# Altium project alarm.PrjPcb
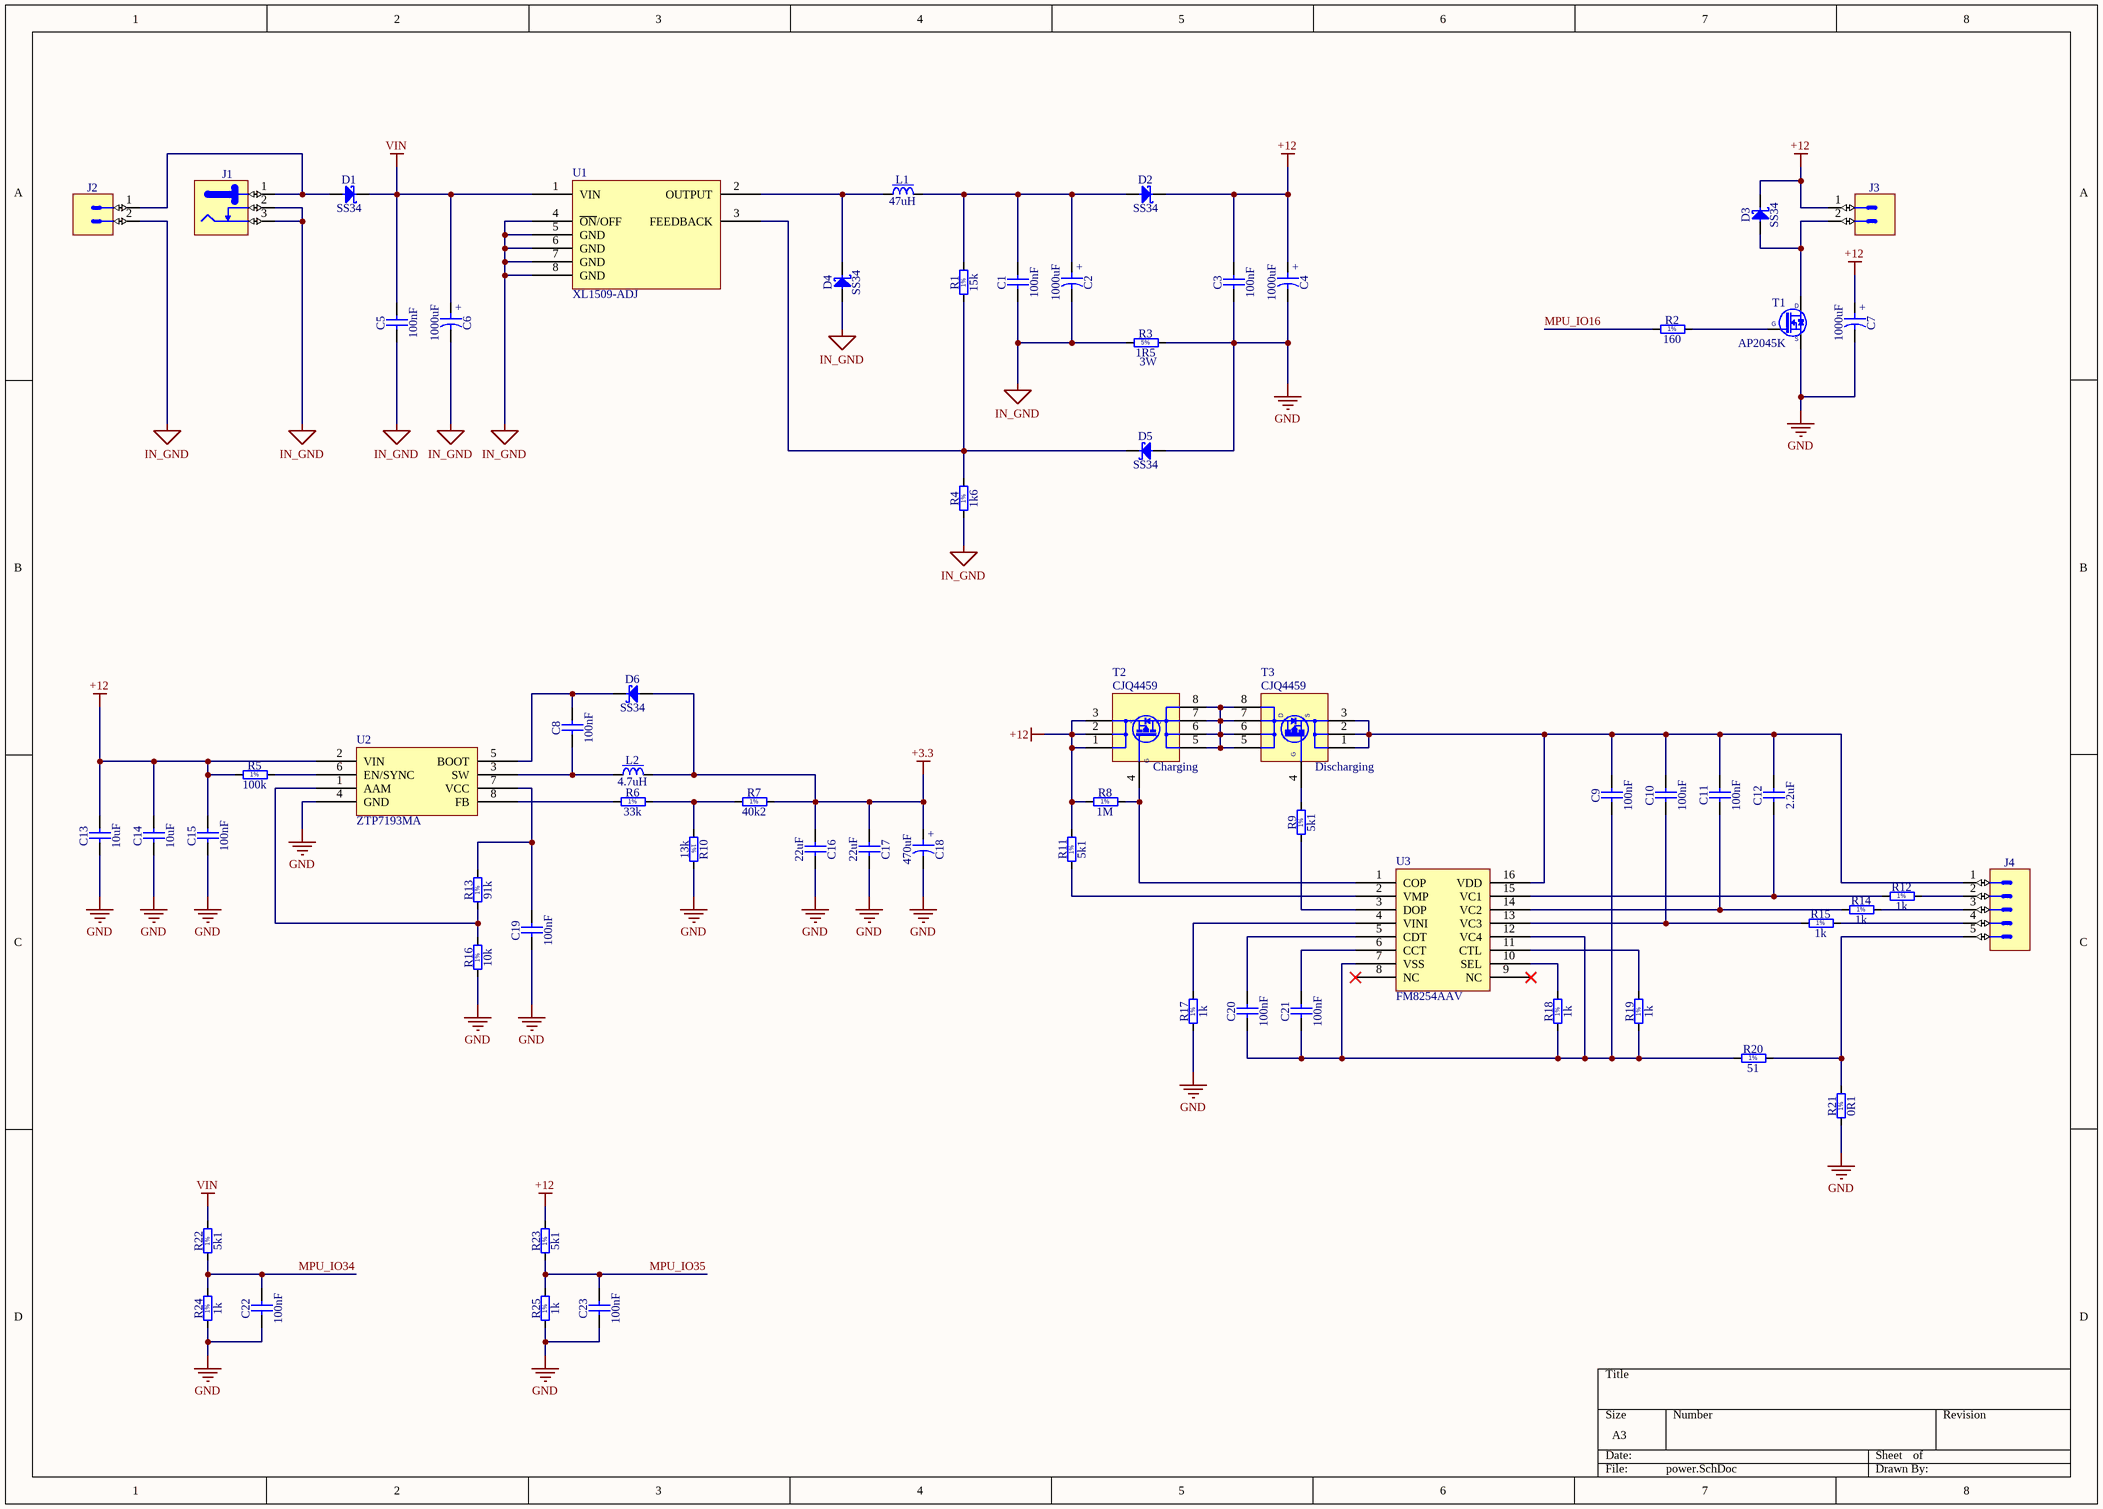
[diagram p0: power.SchDoc]
2 sheets, 80 parts. Net scope: global (net labels, ports and power ports of the same name join across sheets).
Board files: PCB1.PcbDoc, PCB2.PcbDoc
Sheets:
  power.SchDoc
  mpu.SchDoc

## Sheet power.SchDoc
size A3; SheetNumber: 1; SheetTotal: 2

### Parts
C1  100nF  [CAPC2012X135N]
C2  1000uF  [CAPPR500-1300X2200]
C3  100nF  [CAPC2012X135N]
C4  1000uF  [CAPPR500-1300X2200]
C5  100nF  [CAPC2012X135N]
C6  1000uF  [CAPPR500-1300X2200]
C7  1000uF  [CAPPR500-1300X2200]
C8  100nF  [CAPC2012X135N]
C9  100nF  [CAPC2012X135N]
C10  100nF  [CAPC2012X135N]
C11  100nF  [CAPC2012X135N]
C12  2.2uF  [CAPC2012X140N]
C13  10uF  [CAPC2012X135N]
C14  10uF  [CAPC2012X135N]
C15  100nF  [CAPC2012X135N]
C16  22uF  [CAPC2012X135N]
C17  22uF  [CAPC2012X135N]
C18  470uF  [CAPPR500-1050X1150]
C19  100nF  [CAPC2012X135N]
C20  100nF  [CAPC2012X135N]
C21  100nF  [CAPC2012X135N]
C22  100nF  [CAPC2012X135N]
C23  100nF  [CAPC2012X135N]
D1  SS34  [DIOM5127X229N]
D2  SS34  [DIOM5127X229N]
D3  SS34  [DIOM5127X229N]
D4  SS34  [DIOM5127X229N]
D5  SS34  [DIOM5127X229N]
D6  SS34  [DIOM5127X229N]
J1  Jack  [CLIFF_FC68148(DC-10A)]  (value not drawn)
J2  Header 2  [WEIDMULLER_1146320000]  (value not drawn)
J3  Header 2  [WEIDMULLER_1146320000]  (value not drawn)
J4  Header 5  [WEIDMULLER_1146410000]  (value not drawn)
L1  47uH  [IND_WURTH_WE-PD_XXL]
L2  4.7uH  [IND_WURTH_WE-TPC-2813]
R1  15k  [RESC2012X60N]
R2  160  [RESC2012X60N]
R3  1R5  [RES2286-1670X520]
R4  1k6  [RESC2012X60N]
R5  100k  [RESC2012X60N]
R6  33k  [RESC2012X60N]
R7  40k2  [RESC2012X60N]
R8  1M  [RESC2012X60N]
R9  5k1  [RESC2012X60N]
R10  13k  [RESC2012X60N]
R11  5k1  [RESC2012X60N]
R12  1k  [RESC2012X60N]
R13  91k  [RESC2012X60N]
R14  1k  [RESC2012X60N]
R15  1k  [RESC2012X60N]
R16  10k  [RESC2012X60N]
R17  1k  [RESC2012X60N]
R18  1k  [RESC2012X60N]
R19  1k  [RESC2012X60N]
R20  51  [RESC2012X60N]
R21  0R1  [RESC6432X89N]
R22  5k1  [RESC2012X60N]
R23  5k1  [RESC2012X60N]
R24  1k  [RESC2012X60N]
R25  1k  [RESC2012X60N]
T1  AP2045K  [TO228P991X239-3N-R552X520]
T2  CJQ4459  [SOIC127P600X175-8N]
T3  CJQ4459  [SOIC127P600X175-8N]
U1  XL1509-ADJ  [TI SOIC-8 D]
U2  ZTP7193MA  [SOT-23-8]
U3  FM8254AAV  [TI TSSOP-16 PW]

### Nets
+3.3: C16.1 C17.1 C18.1 D6.2(A) L2.2 R7.2
+12: C3.2 C4.1 C7.1 C13.2 C14.2 C15.2 D2.1(C) D3.1(C) J3.1 R5.1 R8.1 R11.2 R23.2 T2.1(S) T2.2(S) T2.3(S) U2.2(VIN)
GND: C3.1 C4.2 C7.2 C13.1 C14.1 C15.1 C16.2 C17.2 C18.2 C19.1 C22.1 C23.1 D5.2(A) R3.2 R10.2 R16.1 R17.1 R21.1 R24.1 R25.1 T1.2(S) U2.4(GND)
IN_GND: C1.1 C2.2 C5.1 C6.2 D4.2(A) J1.2 J1.3 J2.2 R3.1 R4.1 U1.4(~{O}~{N}/OFF) U1.5(GND) U1.6(GND) U1.7(GND) U1.8(GND)
VIN: C5.2 C6.1 D1.1(C) R22.2 U1.1(VIN)
MPU_IO16: R2.1
MPU_IO34: C22.2 R22.1 R24.2
MPU_IO35: C23.2 R23.1 R25.2
NetC1_2: C1.2 C2.1 D2.2(A) L1.2 R1.2
NetC8_1: C8.1 L2.1 U2.3(SW)
NetC8_2: C8.2 D6.1(C) U2.5(BOOT)
NetC9_1: C9.1 C20.1 C21.1 R18.1 R19.1 R20.1 U3.7(VSS) U3.12(VC4)
NetC9_2: C9.2 C10.2 C11.2 C12.2 J4.1 T3.1(S) T3.2(S) T3.3(S) U3.16(VDD)
NetC10_1: C10.1 R15.1 U3.13(VC3)
NetC11_1: C11.1 R14.1 U3.14(VC2)
NetC12_1: C12.1 R12.1 U3.15(VC1)
NetC19_2: C19.2 R13.2 U2.7(VCC)
NetC20_2: C20.2 U3.5(CDT)
NetC21_2: C21.2 U3.6(CCT)
NetD1_2: D1.2(A) J1.1 J2.1
NetD3_2: D3.2(A) J3.2 T1.3(D)
NetD4_1: D4.1(C) L1.1 U1.2(OUTPUT)
NetD5_1: D5.1(C) R1.1 R4.2 U1.3(FEEDBACK)
NetJ4_2: J4.2 R12.2
NetJ4_3: J4.3 R14.2
NetJ4_4: J4.4 R15.2
NetJ4_5: J4.5 R20.2 R21.2
NetR2_2: R2.2 T1.1(G)
NetR5_2: R5.2 U2.6(EN/SYNC)
NetR6_1: R6.1 U2.8(FB)
NetR6_2: R6.2 R7.1 R10.1
NetR8_2: R8.2 T2.4(S) U3.1(COP)
NetR9_1: R9.1 U3.3(DOP)
NetR9_2: R9.2 T3.4(S)
NetR11_1: R11.1 U3.2(VMP)
NetR13_1: R13.1 R16.2 U2.1(AAM)
NetR17_2: R17.2 U3.4(VINI)
NetR18_2: R18.2 U3.10(SEL)
NetR19_2: R19.2 U3.11(CTL)
NetT2_5: T2.5(D) T2.6(D) T2.7(D) T2.8(D) T3.5(D) T3.6(D) T3.7(D) T3.8(D)

Not connected (* = marked no-connect by the designer): U3 8(NC)* 9(NC)*

### Notes on the sheet
- (near R3) 3W
- (near T2) Charging
- (near T3) Discharging
- (in symbol CAER_470UF_10V_20%_500-1050X1150_LESR0R015) +
- (in symbol CAER_1000UF_25V_20%_RUBYCON_ZL) +
- (in symbol R0805_1K6_1%_0.125W_100PPM) 1%
- (in symbol R0805_1K_1%_0.125W_100PPM) 1%
- (in symbol R0805_1M_1%_0.125W_100PPM) 1%
- (in symbol R0805_5K1_1%_0.125W_100PPM) 1%
- (in symbol R0805_10K_1%_0.125W_100PPM) 1%
- (in symbol R0805_13K_1%_0.125W_100PPM) 1%
- (in symbol R0805_15K_1%_0.125W_100PPM) 1%
- (in symbol R0805_33K_1%_0.125W_100PPM) 1%
- (in symbol R0805_40K2_1%_0.125W_100PPM) 1%
- (in symbol R0805_51R_1%_0.125W_100PPM) 1%
- (in symbol R0805_91K_1%_0.125W_100PPM) 1%
- (in symbol R0805_100K_1%_0.125W_100PPM) 1%
- (in symbol R0805_160R_1%_0.125W_100PPM) 1%
- (in symbol R2512_0R02_1%_1W_75PPM_VISHAY_WSL) 1%
- (in symbol RMF_1R8_5%_3W_250PPM_2286-1670X520) 5%
- (in symbol SI4425DDY-T1-GE3) G

### Library data of the parts
C1 C3 C5 C8-C11 C15 C19-C23 = CC0805_100NF_50V_10%_X7R: Non-polarised capacitor; Part Description: SMD Multilayer Chip Ceramic Capacitor; Manufacturer: GENERIC; Manufacturer1 Part Number: C2012X7R1H104K085AA; Voltage: 50V; TC: X7R; Tolerance: ±10%; Part Number: CC0805_100NF_50V_10%_X7R; Component Kind: Standard; Component Type: Standard; Pin Count: 2; Value: 100nF; Status: Preferred; Manufacturer Part Number: CC0805_100NF_50V_10%_X7R; Case: 0805; Mounted: Yes; Socket: No; SMD: Yes; Sense: No; Manufacturer1 Example: TDK; Manufacturer1 ComponentHeight: 1mm; HelpURL: \\cern.ch\dfs\Applications\Altium\Datasheets\CC0805_X7R_TDK_C.pdf; Author: CERN DEM JLC; CreateDate: 03.12.2007; LatestRevisionDate: 22.04.2015
C2 C4 C6 C7 = CAER_1000UF_25V_20%_RUBYCON_ZL: Polarised capacitor; Part Description: Aluminum Electrolytic Capacitor (ZL Series); Manufacturer Part Number: 25ZL1000MEFC12.5X20; Voltage: 25V; Tolerance: ±20%; Part Number: CAER_1000UF_25V_20%_RUBYCON_ZL; Component Kind: Standard; Component Type: Standard; Pin Count: 2; Value: 1000uF; Status: None; Manufacturer: RUBYCON; Case: LS5 D13 x H22; Mounted: Yes; Socket: No; SMD: No; Sense: No; ComponentHeight: 22mm; HelpURL: \\cern.ch\dfs\Applications\Altium\Datasheets\CAER_RUBYCON_ZL.pdf; Author: CERN DEM JLC; CreateDate: 20.12.2011; LatestRevisionDate: 20.12.2011
C12 = CC0805_2.2UF_50V_10%_X7R: Non-polarised capacitor; Part Description: SMD Multilayer Chip Ceramic Capacitor; Manufacturer: GENERIC; Manufacturer1 Part Number: GRM21BR61H225KA73L; Voltage: 50V; TC: X7R; Tolerance: ±10%; Part Number: CC0805_2.2UF_50V_10%_X7R; Component Kind: Standard; Component Type: Standard; Pin Count: 2; Value: 2.2uF; Status: Preferred; Manufacturer Part Number: CC0805_2.2UF_50V_10%_X7R; Case: 0805; Mounted: Yes; Socket: No; SMD: Yes; Sense: No; Manufacturer1 Example: MURATA; Manufacturer1 ComponentHeight: 1.40mm; HelpURL: \\cern.ch\dfs\Applications\Altium\Datasheets\CC0805_X7R_MURATA_GRM.pdf; Author: CERN DEM JLC; CreateDate: 18.08.2014; LatestRevisionDate: 18.08.2014
C13 C14 = CC0805_10UF_10V_10%_X7R: Non-polarised capacitor; Part Description: SMD Multilayer Chip Ceramic Capacitor; Manufacturer: GENERIC; Manufacturer1 Part Number: GRM21BR71A106KE51L; Voltage: 10V; TC: X7R; Tolerance: ±10%; Part Number: CC0805_10UF_10V_10%_X7R; Component Kind: Standard; Component Type: Standard; Pin Count: 2; Value: 10uF; Status: Preferred; Manufacturer Part Number: CC0805_10UF_10V_10%_X7R; Case: 0805; Mounted: Yes; Socket: No; SMD: Yes; Sense: No; Manufacturer1 Example: MURATA; Manufacturer1 ComponentHeight: 1.35mm; HelpURL: \\cern.ch\dfs\Applications\Altium\Datasheets\CC0805_X7R_MURATA.pdf; Author: CERN DEM JLC; CreateDate: 30.04.2012; LatestRevisionDate: 30.04.2012
C16 C17 = CC0805_22UF_6.3V_20%_X5R: Non-polarised capacitor; Part Description: SMD Multilayer Chip Ceramic Capacitor; Manufacturer: GENERIC; Manufacturer1 Part Number: C0805C226M9PAC7800; Voltage: 6.3V; TC: X5R; Tolerance: ±20%; Part Number: CC0805_22UF_6.3V_20%_X5R; Component Kind: Standard; Component Type: Standard; Pin Count: 2; Value: 22uF; Status: Preferred; Manufacturer Part Number: CC0805_22UF_6.3V_20%_X5R; Case: 0805; Mounted: Yes; Socket: No; SMD: Yes; Sense: No; Manufacturer1 Example: KEMET; Manufacturer1 ComponentHeight: 1.45mm; HelpURL: \\cern.ch\dfs\Applications\Altium\Datasheets\CC1206_X5R_KEMET.pdf; Author: CERN DEM JLC; CreateDate: 03.12.2007; LatestRevisionDate: 03.12.2007
C18 = CAER_470UF_10V_20%_500-1050X1150_LESR0R015: Polarised capacitor; Part Description: Low ESR 0R015 Aluminum Solid Capacitor With Organic Semiconductive Electrolyte; Manufacturer: SANYO OS-CON; Manufacturer Part Number: 10SP470M; Voltage: 10V; Tolerance: ±20%; Part Number: CAER_470UF_10V_20%_500-1050X1150_LESR0R015; Component Kind: Standard; Component Type: Standard; Pin Count: 2; Value: 470uF; Status: Obsolete; Case: LS5 D10.5 x H11.5; Mounted: Yes; Socket: No; SMD: No; Sense: No; ComponentHeight: 11.5mm; HelpURL: \\cern.ch\dfs\Applications\Altium\Datasheets\CAER-LESR_SANYO_SP.pdf; Author: CERN DEM JLC; CreateDate: 29.01.2008; LatestRevisionDate: 16.03.2009
D1-D6 = SS16: Schottky Diode; Part Number: SS16; Part Description: Surface Mount Schottky Barrier Rectifier; Manufacturer: VISHAY GENERAL SEMICONDUCTOR; Voltage: 60V; Power: 1A; PressFit: No; Bonding: No; Component Kind: Standard; Component Type: Standard; Device: SS16; PackageDescription: DO-214-AC Molded Diode, Body 5.1x2.7mm, IPC Medium Density; Manufacturer Part Number: SS16; Pin Count: 2; Case: DO-214AC; Mounted: Yes; Socket: No; SMD: Yes; Sense: No; ComponentHeight: 2.29mm; HelpURL: \\cern.ch\dfs\Applications\Altium\Datasheets\SS16.pdf; Author: CERN DEM JLC; CreateDate: 15.07.2008; LatestRevisionDate: 23.08.2010
J1 = CLIFF_FC68148(DC-10A): 12V /  5A, 2.1mm Diameter Pin, DC Power Socket With  Switch. DC10A Type; Part Description: 12V/5A, 2.1mm Diameter Pin, DC Power Socket With  Switch (DC10A Type); Manufacturer: CLIFF ELECTRONIC COMPONENTS; PressFit: No; Part Number: CLIFF_FC68148(DC-10A); Component Kind: Standard; Component Type: Standard; Pin Count: 3; Family: Jack; Mounted: Yes; Socket: No; SMD: No; Sense: No; Status: None; Manufacturer Part Number: FC68148 (DC-10A); ComponentHeight: 11mm; HelpURL: \\cern.ch\dfs\Applications\Altium\Datasheets\CLIFF_FC68148(DC-10A).pdf; Author: CERN DEM JLC; CreateDate: 23.11.2010; LatestRevisionDate: 23.11.2010
J2 = WEIDMULLER_1146320000: Connector 2 Male; Part Description: 24A 400 V, Pitch 5.08mm, 2 Positions Male Header, SL 5.08HC Series; Manufacturer Part Number: 1146320000 or SL 5.08HC/02/180 3.2SN OR BX; PressFit: No; Part Number: WEIDMULLER_1146320000; Component Kind: Standard; Component Type: Standard; Pin Count: 2; Family: Header 2; Mounted: Yes; Socket: No; Sense: No; SMD: No; Status: None; Manufacturer: WEIDMULLER; ComponentHeight: 12mm; HelpURL: \\cern.ch\dfs\Applications\Altium\Datasheets\WEIDMULLER_1146320000.pdf; Author: CERN DEM JLC; CreateDate: 18.01.2012; LatestRevisionDate: 23.01.2012
J3 = WEIDMULLER_1146320000: Connector 2 Male; pin to pad: 1>2 2>1; Part Description: 24A 400 V, Pitch 5.08mm, 2 Positions Male Header, SL 5.08HC Series; Manufacturer Part Number: 1146320000 or SL 5.08HC/02/180 3.2SN OR BX; PressFit: No; Part Number: WEIDMULLER_1146320000; Component Kind: Standard; Component Type: Standard; Pin Count: 2; Family: Header 2; Mounted: Yes; Socket: No; Sense: No; SMD: No; Status: None; Manufacturer: WEIDMULLER; ComponentHeight: 12mm; HelpURL: \\cern.ch\dfs\Applications\Altium\Datasheets\WEIDMULLER_1146320000.pdf; Author: CERN DEM JLC; CreateDate: 18.01.2012; LatestRevisionDate: 23.01.2012
J4 = WEIDMULLER_1146410000: Connector 5 Male; Part Description: 24A 400 V, Pitch 5.08mm, 5 Positions Male Header, SL 5.08HC Series; Manufacturer Part Number: 1146410000 or SL 5.08HC/05/180 3.2SN OR BX; PressFit: No; Part Number: WEIDMULLER_1146410000; Component Kind: Standard; Component Type: Standard; Pin Count: 5; Family: Header 5; Mounted: Yes; Socket: No; Sense: No; SMD: No; Status: None; Manufacturer: WEIDMULLER; ComponentHeight: 12mm; HelpURL: \\cern.ch\dfs\Applications\Altium\Datasheets\WEIDMULLER_1146410000.pdf; Author: CERN DEM JLC; CreateDate: 18.01.2012; LatestRevisionDate: 23.01.2012
L1 = IND_47UH_20%_WURTH_WE-PD_7447709470: Inductor With Core; Part Description: Power-Choke Inductor (WE-PD Series); Manufacturer: WURTH ELEKTRONIK; Power: 3.8A; Resistance: 0.06R; Tolerance: ±20%; Part Number: IND_47UH_20%_WURTH_WE-PD_7447709470; Component Kind: Standard; Component Type: Standard; Pin Count: 2; Value: 47uH; Status: None; Manufacturer Part Number: 7447709470; Mounted: Yes; Socket: No; SMD: Yes; Sense: No; ComponentHeight: 10mm; HelpURL: \\cern.ch\dfs\Applications\Altium\Datasheets\IND_WURTH_WE-PD_7447709470.pdf; Author: CERN DEM JLC; CreateDate: 02.05.2011; LatestRevisionDate: 24.01.2012
L2 = IND_4.7UH_30%_WURTH_WE-TPC_744029004: Inductor With Core; Part Description: Shielded Tiny Power Inductor (WE-TPC Series); Manufacturer: WURTH ELEKTRONIK; Power: 1A; Resistance: 0.017R; Tolerance: ±30%; Part Number: IND_4.7UH_30%_WURTH_WE-TPC_744029004; Component Kind: Standard; Component Type: Standard; Pin Count: 2; Value: 4.7uH; Status: None; Manufacturer Part Number: 744029004; Mounted: Yes; Socket: No; SMD: Yes; Sense: No; ComponentHeight: 3mm; HelpURL: \\cern.ch\dfs\Applications\Altium\Datasheets\IND_WURTH_WE-TPC_744029004.pdf; Author: CERN DEM JLC; CreateDate: 20.11.2014; LatestRevisionDate: 20.11.2014
R1 = R0805_15K_1%_0.125W_100PPM: Resistor - 1%; Part Description: General Purpose Thick Film Chip Resistor; Manufacturer: GENERIC; Manufacturer1 Part Number: NRC10F1502TRF; Power: 0.125W; TC: ±100ppm/°C; PressFit: No; Part Number: R0805_15K_1%_0.125W_100PPM; Component Kind: Standard; Component Type: Standard; Pin Count: 2; Value: 15k; Status: Preferred; Tolerance: ±1%; Manufacturer Part Number: R0805_15K_1%_0.125W_100PPM; Case: 0805; Mounted: Yes; Sense: No; Socket: No; SMD: Yes; Manufacturer1 Example: NIC COMPONENT; Manufacturer1 ComponentHeight: 0.6mm; HelpURL: \\cern.ch\dfs\Applications\Altium\Datasheets\R0805_NIC_NRC.pdf; Author: CERN DEM JLC; CreateDate: 13.05.2013; LatestRevisionDate: 13.05.2013
R2 = R0805_160R_1%_0.125W_100PPM: Resistor - 1%; Part Description: General Purpose Thick Film Chip Resistor; Manufacturer: GENERIC; Manufacturer1 Part Number: NRC10F1600TRF; Power: 0.125W; TC: ±100ppm/°C; PressFit: No; Part Number: R0805_160R_1%_0.125W_100PPM; Component Kind: Standard; Component Type: Standard; Pin Count: 2; Value: 160; Status: Preferred; Tolerance: ±1%; Manufacturer Part Number: R0805_160R_1%_0.125W_100PPM; Case: 0805; Mounted: Yes; Sense: No; Socket: No; SMD: Yes; Manufacturer1 Example: NIC COMPONENT; Manufacturer1 ComponentHeight: 0.6mm; HelpURL: \\cern.ch\dfs\Applications\Altium\Datasheets\R0805_NIC_NRC.pdf; Author: CERN DEM JLC; CreateDate: 03.12.2007; LatestRevisionDate: 13.03.2008
R3 = RMF_1R8_5%_3W_250PPM_2286-1670X520: Resistor - 5%; Part Description: Leaded Power Metal Film Resistor; Manufacturer: GENERIC; Manufacturer1 Part Number: PR03000201808JAC00; Value: 1R8; Power: 3W; TC: ±250ppm/°C; PressFit: No; Part Number: RMF_1R8_5%_3W_250PPM_2286-1670X520; Component Kind: Standard; Component Type: Standard; Pin Count: 2; Status: Preferred; Tolerance: ±5%; Manufacturer Part Number: RMF_1R8_5%_3W_250PPM_2286-1670X520; Case: LS22.86 L16.7 x D5.2; Mounted: Yes; Sense: No; Socket: No; SMD: No; ComponentHeight: 5.2mm; Manufacturer1 Example: VISHAY BCCOMPONENT; Manufacturer1 ComponentHeight: 5.2mm; HelpURL: \\cern.ch\dfs\Applications\Altium\Datasheets\RMF_VISHAY_PR03.pdf; Author: CERN DEM JLC; CreateDate: 19.06.2008; LatestRevisionDate: 01.10.2012
R4 = R0805_1K6_1%_0.125W_100PPM: Resistor - 1%; Part Description: General Purpose Thick Film Chip Resistor; Manufacturer: GENERIC; Manufacturer1 Part Number: NRC10F1601TRF; Power: 0.125W; TC: ±100ppm/°C; PressFit: No; Part Number: R0805_1K6_1%_0.125W_100PPM; Component Kind: Standard; Component Type: Standard; Pin Count: 2; Value: 1k6; Status: Preferred; Tolerance: ±1%; Manufacturer Part Number: R0805_1K6_1%_0.125W_100PPM; Case: 0805; Mounted: Yes; Sense: No; Socket: No; SMD: Yes; Manufacturer1 Example: NIC COMPONENT; Manufacturer1 ComponentHeight: 0.6mm; HelpURL: \\cern.ch\dfs\Applications\Altium\Datasheets\R0805_NIC_NRC.pdf; Author: CERN DEM JLC; CreateDate: 03.12.2007; LatestRevisionDate: 13.03.2008
R5 = R0805_100K_1%_0.125W_100PPM: Resistor - 1%; Part Description: General Purpose Thick Film Chip Resistor; Manufacturer: GENERIC; Manufacturer1 Part Number: NRC10F1003TRF; Power: 0.125W; TC: ±100ppm/°C; PressFit: No; Part Number: R0805_100K_1%_0.125W_100PPM; Component Kind: Standard; Component Type: Standard; Pin Count: 2; Value: 100k; Status: Preferred; Tolerance: ±1%; Manufacturer Part Number: R0805_100K_1%_0.125W_100PPM; Case: 0805; Mounted: Yes; Sense: No; Socket: No; SMD: Yes; Manufacturer1 Example: NIC COMPONENT; Manufacturer1 ComponentHeight: 0.6mm; HelpURL: \\cern.ch\dfs\Applications\Altium\Datasheets\R0805_NIC_NRC.pdf; Author: CERN DEM JLC; CreateDate: 03.12.2007; LatestRevisionDate: 13.03.2008
R6 = R0805_33K_1%_0.125W_100PPM: Resistor - 1%; Part Description: General Purpose Thick Film Chip Resistor; Manufacturer: GENERIC; Manufacturer1 Part Number: NRC10F3302TRF; Power: 0.125W; TC: ±100ppm/°C; PressFit: No; Part Number: R0805_33K_1%_0.125W_100PPM; Component Kind: Standard; Component Type: Standard; Pin Count: 2; Value: 33k; Status: Preferred; Tolerance: ±1%; Manufacturer Part Number: R0805_33K_1%_0.125W_100PPM; Case: 0805; Mounted: Yes; Sense: No; Socket: No; SMD: Yes; Manufacturer1 Example: NIC COMPONENT; Manufacturer1 ComponentHeight: 0.6mm; HelpURL: \\cern.ch\dfs\Applications\Altium\Datasheets\R0805_NIC_NRC.pdf; Author: CERN DEM JLC; CreateDate: 03.12.2007; LatestRevisionDate: 13.03.2008
R7 = R0805_40K2_1%_0.125W_100PPM: Resistor - 1%; Part Description: Thick Film Chip Resistor; Manufacturer: VISHAY; Manufacturer1 Part Number: CRCW080540K2FKEA; Power: 0.125W; TC: ±100ppm/°C; PressFit: No; Part Number: R0805_40K2_1%_0.125W_100PPM; Component Kind: Standard; Component Type: Standard; Pin Count: 2; Value: 40k2; Status: None; Tolerance: ±1%; Manufacturer Part Number: R0805_40K2_1%_0.125W_100PPM; Case: 0805; Mounted: Yes; Sense: No; Socket: No; SMD: Yes; Manufacturer1 Example: VISHAY; Manufacturer1 ComponentHeight: 0.6mm; HelpURL: \\cern.ch\dfs\Applications\Altium\Datasheets\R2512_VISHAY_CRCW0805.pdf; Author: CERN DEM JLC; CreateDate: 18.04.2013; LatestRevisionDate: 18.04.2013
R8 = R0805_1M_1%_0.125W_100PPM: Resistor - 1%; Part Description: General Purpose Thick Film Chip Resistor; Manufacturer: GENERIC; Manufacturer1 Part Number: NRC10F1004TRF; Power: 0.125W; TC: ±100ppm/°C; PressFit: No; Part Number: R0805_1M_1%_0.125W_100PPM; Component Kind: Standard; Component Type: Standard; Pin Count: 2; Value: 1M; Status: Preferred; Tolerance: ±1%; Manufacturer Part Number: R0805_1M_1%_0.125W_100PPM; Case: 0805; Mounted: Yes; Sense: No; Socket: No; SMD: Yes; Manufacturer1 Example: NIC COMPONENT; Manufacturer1 ComponentHeight: 0.6mm; HelpURL: \\cern.ch\dfs\Applications\Altium\Datasheets\R0805_NIC_NRC.pdf; Author: CERN DEM JLC; CreateDate: 03.12.2007; LatestRevisionDate: 13.03.2008
R9 R11 R22 R23 = R0805_5K1_1%_0.125W_100PPM: Resistor - 1%; Part Description: General Purpose Thick Film Chip Resistor; Manufacturer: GENERIC; Manufacturer1 Part Number: NRC10F5101TRF; Power: 0.125W; TC: ±100ppm/°C; PressFit: No; Part Number: R0805_5K1_1%_0.125W_100PPM; Component Kind: Standard; Component Type: Standard; Pin Count: 2; Value: 5k1; Status: Preferred; Tolerance: ±1%; Manufacturer Part Number: R0805_5K1_1%_0.125W_100PPM; Case: 0805; Mounted: Yes; Sense: No; Socket: No; SMD: Yes; Manufacturer1 Example: NIC COMPONENT; Manufacturer1 ComponentHeight: 0.6mm; HelpURL: \\cern.ch\dfs\Applications\Altium\Datasheets\R0805_NIC_NRC.pdf; Author: CERN DEM JLC; CreateDate: 03.12.2007; LatestRevisionDate: 13.03.2008
R10 = R0805_13K_1%_0.125W_100PPM: Resistor - 1%; Part Description: General Purpose Thick Film Chip Resistor; Manufacturer: GENERIC; Manufacturer1 Part Number: NRC10F1302TRF; Power: 0.125W; TC: ±100ppm/°C; PressFit: No; Part Number: R0805_13K_1%_0.125W_100PPM; Component Kind: Standard; Component Type: Standard; Pin Count: 2; Value: 13k; Status: Preferred; Tolerance: ±1%; Manufacturer Part Number: R0805_13K_1%_0.125W_100PPM; Case: 0805; Mounted: Yes; Sense: No; Socket: No; SMD: Yes; Manufacturer1 Example: NIC COMPONENT; Manufacturer1 ComponentHeight: 0.6mm; HelpURL: \\cern.ch\dfs\Applications\Altium\Datasheets\R0805_NIC_NRC.pdf; Author: CERN DEM JLC; CreateDate: 03.12.2007; LatestRevisionDate: 13.03.2008
R12 R14 R15 R17-R19 R24 R25 = R0805_1K_1%_0.125W_100PPM: Resistor - 1%; Part Description: General Purpose Thick Film Chip Resistor; Manufacturer: GENERIC; Manufacturer1 Part Number: NRC10F1001TRF; Power: 0.125W; TC: ±100ppm/°C; PressFit: No; Part Number: R0805_1K_1%_0.125W_100PPM; Component Kind: Standard; Component Type: Standard; Pin Count: 2; Value: 1k; Status: Preferred; Tolerance: ±1%; Manufacturer Part Number: R0805_1K_1%_0.125W_100PPM; Case: 0805; Mounted: Yes; Sense: No; Socket: No; SMD: Yes; Manufacturer1 Example: NIC COMPONENT; Manufacturer1 ComponentHeight: 0.6mm; HelpURL: \\cern.ch\dfs\Applications\Altium\Datasheets\R0805_NIC_NRC.pdf; Author: CERN DEM JLC; CreateDate: 03.12.2007; LatestRevisionDate: 13.03.2008
R13 = R0805_91K_1%_0.125W_100PPM: Resistor - 1%; Part Description: General Purpose Thick Film Chip Resistor; Manufacturer: GENERIC; Manufacturer1 Part Number: NRC10F9102TRF; Power: 0.125W; TC: ±100ppm/°C; PressFit: No; Part Number: R0805_91K_1%_0.125W_100PPM; Component Kind: Standard; Component Type: Standard; Pin Count: 2; Value: 91k; Status: Preferred; Tolerance: ±1%; Manufacturer Part Number: R0805_91K_1%_0.125W_100PPM; Case: 0805; Mounted: Yes; Sense: No; Socket: No; SMD: Yes; Manufacturer1 Example: NIC COMPONENT; Manufacturer1 ComponentHeight: 0.6mm; HelpURL: \\cern.ch\dfs\Applications\Altium\Datasheets\R0805_NIC_NRC.pdf; Author: CERN DEM JLC; CreateDate: 03.12.2007; LatestRevisionDate: 13.03.2008
R16 = R0805_10K_1%_0.125W_100PPM: Resistor - 1%; Part Description: General Purpose Thick Film Chip Resistor; Manufacturer: GENERIC; Manufacturer1 Part Number: NRC10F1002TRF; Power: 0.125W; TC: ±100ppm/°C; PressFit: No; Part Number: R0805_10K_1%_0.125W_100PPM; Component Kind: Standard; Component Type: Standard; Pin Count: 2; Value: 10k; Status: Preferred; Tolerance: ±1%; Manufacturer Part Number: R0805_10K_1%_0.125W_100PPM; Case: 0805; Mounted: Yes; Sense: No; Socket: No; SMD: Yes; Manufacturer1 Example: NIC COMPONENT; Manufacturer1 ComponentHeight: 0.6mm; HelpURL: \\cern.ch\dfs\Applications\Altium\Datasheets\R0805_NIC_NRC.pdf; Author: CERN DEM JLC; CreateDate: 03.12.2007; LatestRevisionDate: 13.03.2008
R20 = R0805_51R_1%_0.125W_100PPM: Resistor - 1%; Part Description: General Purpose Thick Film Chip Resistor; Manufacturer: GENERIC; Manufacturer1 Part Number: NRC10F51R0TRF; Power: 0.125W; TC: ±100ppm/°C; PressFit: No; Part Number: R0805_51R_1%_0.125W_100PPM; Component Kind: Standard; Component Type: Standard; Pin Count: 2; Value: 51; Status: Preferred; Tolerance: ±1%; Manufacturer Part Number: R0805_51R_1%_0.125W_100PPM; Case: 0805; Mounted: Yes; Sense: No; Socket: No; SMD: Yes; Manufacturer1 Example: NIC COMPONENT; Manufacturer1 ComponentHeight: 0.6mm; HelpURL: \\cern.ch\dfs\Applications\Altium\Datasheets\R0805_NIC_NRC.pdf; Author: CERN DEM JLC; CreateDate: 03.12.2007; LatestRevisionDate: 13.03.2008
R21 = R2512_0R02_1%_1W_75PPM_VISHAY_WSL: Resistor - 1%; Part Description: Power Metal Strip® Resistor; Manufacturer: VISHAY DALE; Manufacturer Part Number: WSL2512R0200FEA; Value: 0R02; Power: 1W; TC: ±75ppm/°C; PressFit: No; Part Number: R2512_0R02_1%_1W_75PPM_VISHAY_WSL; Component Kind: Standard; Component Type: Standard; Pin Count: 2; Status: None; Tolerance: ±1%; Case: 2512; Mounted: Yes; Sense: No; Socket: No; SMD: Yes; ComponentHeight: 0.89mm; HelpURL: \\cern.ch\dfs\Applications\Altium\Datasheets\R2512_VISHAY_WSL.pdf; Author: CERN DEM JLC; CreateDate: 17.11.2011; LatestRevisionDate: 17.11.2011
T1 = IPD600N25N3 G: N-CHANNEL MOSFET WITH DIODE; Part Description: 250V 25A N-Channel OptiMOS Power MOSFET; Manufacturer: INFINEON; PressFit: No; Bonding: No; Part Number: IPD600N25N3 G; Component Kind: Standard; Component Type: Standard; Device: IPD600N25N3 G; PackageDescription: TO-252AA DPAK TO, 2.28mm pitch; 2 pin,9.905mm L X 6.095mm W X 2.39mm H body, IPC Medium Density; Manufacturer Part Number: IPD600N25N3 G; Pin Count: 3; Case: DPAK; Mounted: Yes; Socket: No; SMD: Yes; Sense: No; ComponentHeight: 2.41mm; HelpURL: \\cern.ch\dfs\Applications\Altium\Datasheets\IPD600N25N3 G.pdf; Author: CERN DEM JLC; CreateDate: 09.03.2015; LatestRevisionDate: 09.03.2015
T2 T3 = SI4425DDY-T1-GE3: -30V -19.7A P-Channel MOSFET; Manufacturer: VISHAY SILICONIX; PressFit: No; Bonding: No; Part Number: SI4425DDY-T1-GE3; Component Kind: Standard; Component Type: Standard; Device: SI4425DDY-T1-GE3; PackageDescription: SOIC 8, Pitch 1.27mm - Body 4x5mm, IPC Medium Density; Part Description: -30V -19.7A P-Channel MOSFET; Manufacturer Part Number: SI4425DDY-T1-GE3; Pin Count: 8; Case: SOIC8; Mounted: Yes; Socket: No; SMD: Yes; Sense: No; ComponentHeight: 1.75mm; HelpURL: \\cern.ch\dfs\Applications\Altium\Datasheets\SI4425DDY-T1-GE3.pdf; Author: CERN DEM MR; CreateDate: 05.10.2016; LatestRevisionDate: 05.10.2016
U1 = XL1509-ADJ: SOIC-8 DC-DC Converters ROHS
U2 = ZTP7193MA: -40℃~+125℃@(Ta) 1 Step-Down 0.8V~15V 4.5V~18V 3A 3μA 500kHz TSOT23-8 DC-DC Converters ROHS
U3 = FM8254AAV: TSSOP-16 Battery Management ICs ROHS

## Sheet mpu.SchDoc
size A4; SheetNumber: 2; SheetTotal: 2
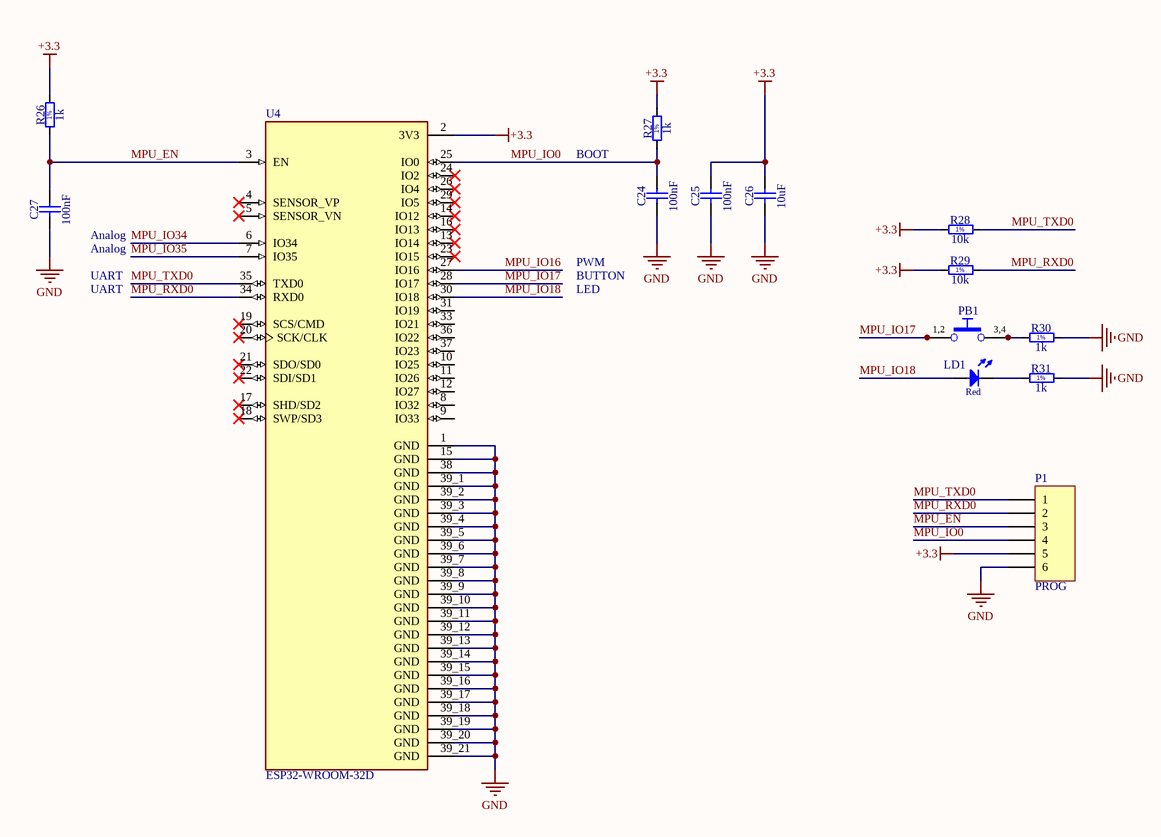
[diagram p1: mpu.SchDoc]

### Parts
C24  100nF  [CAPC2012X135N]
C25  100nF  [CAPC2012X135N]
C26  10uF  [CAPC2012X135N]
C27  100nF  [CAPC2012X135N]
LD1  Red  [LED_OSRAM_LHN974]  (value not drawn)
P1  PROG  [HDR1X6]
PB1  Push Button  [PB_OMRON_B3F-1000]  (value not drawn)
R26  1k  [RESC2012X60N]
R27  1k  [RESC2012X60N]
R28  10k  [RESC2012X60N]
R29  10k  [RESC2012X60N]
R30  1k  [RESC2012X60N]
R31  1k  [RESC2012X60N]
U4  ESP32-WROOM-32D  [MODULE_ESP32-WROOM-32D]

### Nets
+3.3: C25.2 C26.2 P1.5 R26.2 R27.2 R28.1 R29.1 U4.2(3V3)
GND: C24.1 C25.1 C26.1 C27.1 P1.6 R30.2 R31.2 U4.1(GND) U4.15(GND) U4.38(GND) U4.39_1(GND) U4.39_2(GND) U4.39_3(GND) U4.39_4(GND) U4.39_5(GND) U4.39_6(GND) U4.39_7(GND) U4.39_8(GND) U4.39_9(GND) U4.39_10(GND) U4.39_11(GND) U4.39_12(GND) U4.39_13(GND) U4.39_14(GND) U4.39_15(GND) U4.39_16(GND) U4.39_17(GND) U4.39_18(GND) U4.39_19(GND) U4.39_20(GND) U4.39_21(GND)
MPU_EN: C27.2 P1.3 R26.1 U4.3(EN)
MPU_IO0: C24.2 P1.4 R27.1 U4.25(IO0)
MPU_IO16: U4.27(IO16)
MPU_IO17: PB1.1 PB1.2 U4.28(IO17)
MPU_IO18: LD1.2(A) U4.30(IO18)
MPU_IO34: U4.6(IO34)
MPU_IO35: U4.7(IO35)
MPU_RXD0: P1.2 R29.2 U4.34(RXD0)
MPU_TXD0: P1.1 R28.2 U4.35(TXD0)
NetLD1_1: LD1.1(C) R31.1
NetPB1_3: PB1.3 PB1.4 R30.1

Not connected (* = marked no-connect by the designer): U4 4(SENSOR_VP)* 5(SENSOR_VN)* 8(IO32) 9(IO33) 10(IO25) 11(IO26) 12(IO27) 13(IO14)* 14(IO12)* 16(IO13)* 17(SHD/SD2)* 18(SWP/SD3)* 19(SCS/CMD)* 20(SCK/CLK)* 21(SDO/SD0)* 22(SDI/SD1)* 23(IO15)* 24(IO2)* 26(IO4)* 29(IO5)* 31(IO19) 33(IO21) 36(IO22) 37(IO23)

### Notes on the sheet
- BOOT
- (near C27) Analog
- UART
- BUTTON
- PWM
- LED
- (in symbol PB_OMRON_B3F-1000) 1,2; 3,4
- (in symbol R0805_1K_1%_0.125W_100PPM) 1%
- (in symbol R0805_10K_1%_0.125W_100PPM) 1%

### Library data of the parts
C24 C25 C27 = CC0805_100NF_50V_10%_X7R: as C1 on sheet power; Part Number: CC0805_100NF_50V_10%_X7R; Component Kind: Standard; Component Type: Standard; Pin Count: 2; Value: 100nF; Status: Preferred; Manufacturer Part Number: CC0805_100NF_50V_10%_X7R; Case: 0805; Mounted: Yes; Socket: No; SMD: Yes; Sense: No; Manufacturer1 Example: TDK; Manufacturer1 ComponentHeight: 1mm; HelpURL: \\cern.ch\dfs\Applications\Altium\Datasheets\CC0805_X7R_TDK_C.pdf; Author: CERN DEM JLC; CreateDate: 03.12.2007; LatestRevisionDate: 22.04.2015
C26 = CC0805_10UF_10V_10%_X7R: as C13 on sheet power; Part Number: CC0805_10UF_10V_10%_X7R; Component Kind: Standard; Component Type: Standard; Pin Count: 2; Value: 10uF; Status: Preferred; Manufacturer Part Number: CC0805_10UF_10V_10%_X7R; Case: 0805; Mounted: Yes; Socket: No; SMD: Yes; Sense: No; Manufacturer1 Example: MURATA; Manufacturer1 ComponentHeight: 1.35mm; HelpURL: \\cern.ch\dfs\Applications\Altium\Datasheets\CC0805_X7R_MURATA.pdf; Author: CERN DEM JLC; CreateDate: 30.04.2012; LatestRevisionDate: 30.04.2012
LD1 = LED_OSRAM_LHN974: LED Red 1C 2A; Part Description: Surface Mount Red LED (1206 Case); Manufacturer: OSRAM; Manufacturer Part Number: LHN974; PressFit: No; Bonding: No; Part Number: LED_OSRAM_LHN974; Component Kind: Standard; Component Type: Standard; Color: Red; PackageDescription: Red Chip LED, 2-Leads, Body 3.2 x1.6mm, IPC Medium Density; Pin Count: 2; Case: 1206; Mounted: Yes; Socket: No; SMD: Yes; Sense: No; ComponentHeight: 1.2mm; HelpURL: \\cern.ch\dfs\Applications\Altium\Datasheets\LED_OSRAM_LHN974.pdf; Author: CERN DEM JMW; CreateDate: 16.08.2012; LatestRevisionDate: 16.08.2012
P1 = Header 6: Header, 6-Pin; LatestRevisionDate: 17-Jul-2002; LatestRevisionNote: Re-released for DXP Platform.; Publisher: Altium Limited
PB1 = PB_OMRON_B3F-1000: Push-Button Switch SPDT; Part Description: 24VDC 50mA SPST-NO Tactile Push-Button Switch (h=4.5mm); Manufacturer: OMRON; PressFit: No; Part Number: PB_OMRON_B3F-1000; Component Kind: Standard; Component Type: Standard; Pin Count: 4; PackageDescription: 6x6mm Model, Horizontal, Flat Plunger Type (without Ground Terminal) Pushbutton Switch, OMRON B3F Series; Family: Push Button; Mounted: Yes; Socket: No; SMD: No; Sense: No; Status: None; Manufacturer Part Number: B3F-1000; ComponentHeight: 4.5mm; HelpURL: \\cern.ch\dfs\Applications\Altium\Datasheets\PB_OMRON_B3F-1000.pdf; Author: CERN DEM JMW; CreateDate: 23.10.2008; LatestRevisionDate: 06.05.2009
R26 R27 R30 R31 = R0805_1K_1%_0.125W_100PPM: as R12 on sheet power; Part Number: R0805_1K_1%_0.125W_100PPM; Component Kind: Standard; Component Type: Standard; Pin Count: 2; Value: 1k; Status: Preferred; Tolerance: ±1%; Manufacturer Part Number: R0805_1K_1%_0.125W_100PPM; Case: 0805; Mounted: Yes; Sense: No; Socket: No; SMD: Yes; Manufacturer1 Example: NIC COMPONENT; Manufacturer1 ComponentHeight: 0.6mm; HelpURL: \\cern.ch\dfs\Applications\Altium\Datasheets\R0805_NIC_NRC.pdf; Author: CERN DEM JLC; CreateDate: 03.12.2007; LatestRevisionDate: 13.03.2008
R28 R29 = R0805_10K_1%_0.125W_100PPM: as R16 on sheet power; Part Number: R0805_10K_1%_0.125W_100PPM; Component Kind: Standard; Component Type: Standard; Pin Count: 2; Value: 10k; Status: Preferred; Tolerance: ±1%; Manufacturer Part Number: R0805_10K_1%_0.125W_100PPM; Case: 0805; Mounted: Yes; Sense: No; Socket: No; SMD: Yes; Manufacturer1 Example: NIC COMPONENT; Manufacturer1 ComponentHeight: 0.6mm; HelpURL: \\cern.ch\dfs\Applications\Altium\Datasheets\R0805_NIC_NRC.pdf; Author: CERN DEM JLC; CreateDate: 03.12.2007; LatestRevisionDate: 13.03.2008
U4 = ESP32-WROOM-32D: Bluetooth, WiFi 802.11b/g/n, Bluetooth v4.2 + EDR, Class 1, 2 and 3 Transceiver Module 2.4GHz ~ 2.5GHz Integrated, Trace Surface Mount; MF: Espressif Systems; Price: None; Package: Module Espressif Systems; Availability: Unavailable; SnapEDA_Link: https://www.snapeda.com/parts/ESP32-WROOM-32D/Espressif%20Systems/view-part/2768115/?ref=snap; Value: *; MP: ESP32-WROOM-32D

## Nets that join several sheets
+3.3: power (6 pins), mpu (8 pins)
GND: power (22 pins), mpu (31 pins)
MPU_IO16: power (R2.1), mpu (U4.27)
MPU_IO34: power (C22.2 R22.1 R24.2), mpu (U4.6)
MPU_IO35: power (C23.2 R23.1 R25.2), mpu (U4.7)